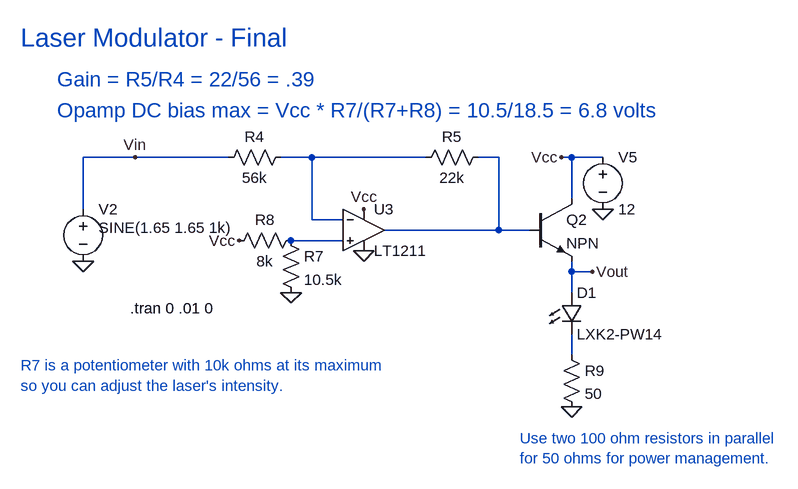
[diagram p0: schematic DAC amp_final.asc]
DAC amp_final.asc, the LTspice schematic file:
Version 4
SHEET 1 2140 964
WIRE 576 272 496 272
WIRE 720 272 576 272
WIRE 848 272 800 272
WIRE 1024 272 848 272
WIRE 1136 272 1104 272
WIRE 1248 272 1232 272
WIRE 1296 272 1248 272
WIRE 1248 336 1248 272
WIRE 496 352 496 272
WIRE 848 368 848 272
WIRE 896 368 848 368
WIRE 1136 384 1136 272
WIRE 1136 384 960 384
WIRE 1184 384 1136 384
WIRE 896 400 816 400
WIRE 1248 448 1248 432
WIRE 1280 448 1248 448
WIRE 1248 480 1248 448
WIRE 1248 576 1248 544
FLAG 496 432 0
FLAG 576 272 Vin
FLAG 736 400 Vcc
FLAG 1232 272 Vcc
FLAG 1296 352 0
FLAG 816 480 0
FLAG 928 416 0
FLAG 928 352 Vcc
FLAG 1280 448 Vout
FLAG 1248 656 0
SYMBOL voltage 496 336 R0
WINDOW 39 0 0 Left 2
WINDOW 123 24 44 Left 2
WINDOW 3 24 44 Left 2
SYMATTR Value SINE(1.65 1.65 1k)
SYMATTR InstName V2
SYMBOL res 816 256 R90
WINDOW 0 0 56 VBottom 2
WINDOW 3 32 56 VTop 2
SYMATTR InstName R4
SYMATTR Value 56k
SYMBOL res 1120 256 R90
WINDOW 0 0 56 VBottom 2
WINDOW 3 32 56 VTop 2
SYMATTR InstName R5
SYMATTR Value 22k
SYMBOL Opamps\\LT1211 928 320 R0
SYMATTR InstName U3
SYMBOL res 800 384 R0
SYMATTR InstName R7
SYMATTR Value 10.5k
SYMBOL res 832 384 R90
WINDOW 0 0 56 VBottom 2
WINDOW 3 32 56 VTop 2
SYMATTR InstName R8
SYMATTR Value 8k
SYMBOL voltage 1296 256 R0
WINDOW 123 0 0 Left 2
WINDOW 39 0 0 Left 2
SYMATTR InstName V5
SYMATTR Value 12
SYMBOL npn 1184 336 R0
SYMATTR InstName Q2
SYMBOL res 1232 560 R0
SYMATTR InstName R9
SYMATTR Value 50
SYMBOL LED 1232 480 R0
SYMATTR InstName D1
SYMATTR Value LXK2-PW14
SYMATTR Description Diode
SYMATTR Type diode
TEXT 568 504 Left 2 !.tran 0 .01 0
TEXT 400 592 Left 2 ;R7 is a potentiometer with 10k ohms at its maximum \nso you can adjust the laser's intensity.
TEXT 400 88 Left 4 ;Laser Modulator - Final
TEXT 456 152 Left 3 ;Gain = R5/R4 = 22/56 = .39
TEXT 456 200 Left 3 ;Opamp DC bias max = Vcc * R7/(R7+R8) = 10.5/18.5 = 6.8 volts
TEXT 1168 704 Left 2 ;Use two 100 ohm resistors in parallel\nfor 50 ohms for power management.

The netlist it stands for:
* DAC amp_final.asc
V2 Vin 0 SINE(1.65 1.65 1k)
R4 N001 Vin 56k
R5 N002 N001 22k
XU3 N003 N001 Vcc 0 N002 LT1211  ; pins In+ In- V+ V- OUT
R7 N003 0 10.5k
R8 N003 Vcc 8k
V5 Vcc 0 12
Q2 Vcc N002 Vout 0 NPN
R9 N004 0 50
D1 Vout N004 LXK2-PW14
.model D D
.lib standard.dio
.model NPN NPN
.model PNP PNP
.lib standard.bjt
.tran 0 .01 0
* R7 is a potentiometer with 10k ohms at its maximum
* so you can adjust the laser's intensity.
* Laser Modulator - Final
* Gain = R5/R4 = 22/56 = .39
* Opamp DC bias max = Vcc * R7/(R7+R8) = 10.5/18.5 = 6.8 volts
* Use two 100 ohm resistors in parallel
* for 50 ohms for power management.
.lib LTC.lib
.backanno
.end